# EAGLE schematic 2 (EAGLE 7.2.0)
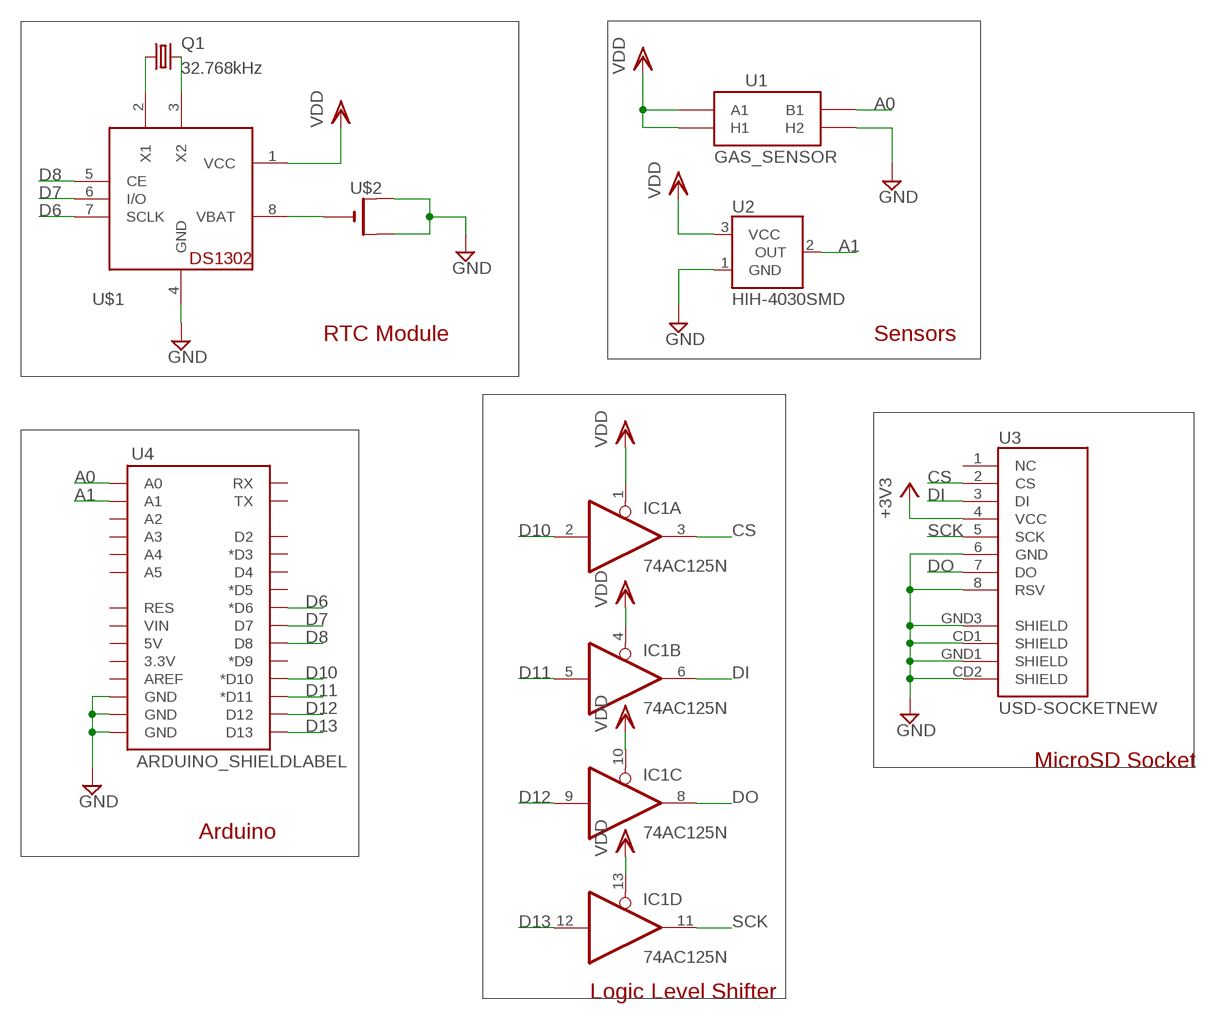
[diagram p0: schematic, sheet 1]

## Parts
IC1  74AC125N  [DIL14]
Q1  32.768kHz  CRYSTALTC38H  [TC38H]
U1  GAS_SENSOR  [MQ-3]
U2  HIH-4030SMD  [HIH-4030]
U3  USD-SOCKETNEW  [MICRO-SD-SOCKET-PP]
U4  ARDUINO_SHIELDLABEL  [DUEMILANOVE_SHIELD]
U$1  DS1302  [DIL08-ROUND]
U$2  CR2032THM  [CR2032-THRU]

## Nets
+3V3: U3.4(VCC)
A0: U1.B1 U4.A0
A1: U2.2(OUT) U4.A1
CS: IC1.3(A:O) U3.2(CS)
D6: U4.D6(*D6) U$1.7(SCLK)
D7: U4.D7 U$1.6(I/O)
D8: U4.D8 U$1.5(CE)
D10: IC1.2(A:I) U4.D10(*D10)
D11: IC1.5(B:I) U4.D11(*D11)
D12: IC1.9(C:I) U4.D12
D13: IC1.12(D:I) U4.D13
DI: IC1.6(B:O) U3.3(DI)
DO: IC1.8(C:O) U3.7(DO)
GND: U1.HB(H2) U2.1(GND) U3.6(GND) U3.8(RSV) U3.CD1(SHIELD) U3.CD2(SHIELD) U3.GND1(SHIELD) U3.GND3(SHIELD) U4.GND@0(GND) U4.GND@1(GND) U4.GND@2(GND) U$1.4(GND) U$2.+1(+) U$2.+2(+1)
N$1: U$1.8(VBAT) U$2.-
N$3: Q1.1 U$1.2(X1)
N$4: Q1.2 U$1.3(X2)
SCK: IC1.11(D:O) U3.5(SCK)
VDD: IC1.1(A:OE) IC1.4(B:OE) IC1.10(C:OE) IC1.13(D:OE) U1.A1 U1.HA(H1) U2.3(VCC) U$1.1(VCC)
Unconnected: U3.1(NC) U4.3.3V U4.5V U4.A2 U4.A3 U4.A4 U4.A5 U4.AREF U4.D2 U4.D3(*D3) U4.D4 U4.D5(*D5) U4.D9(*D9) U4.RES U4.RX U4.TX U4.VIN

## Notes on the sheet
- RTC Module | Sensors
- MicroSD Socket
- Arduino
- Logic Level Shifter

## Power pins joined to a net without a drawn wire
GND: IC1.7(P:GND)
VCC: IC1.14(P:VCC)

## Library data of the parts
IC1 = 74xx-eu:74*125: Quad bus BUFFER, 3-state
Q1 = crystal:CRYSTAL: CRYSTAL; OC_FARNELL: unknown; OC_NEWARK: unknown
U1 = SparkFun:GAS_SENSOR: MQ-3 Gas Sensor. FP not tested. Part#
U2 = SparkFun:HIH-4030: Humidity Sensor
U3 = SparkFun:USD-SOCKET: microSD Socket Push-push type uSD socket. Schematic element and footprint production proven. Spark Fun Electronics SKU : PRT-00127. tDoc lines correctly indicate media card edge positions when inserting (unlocked, locked, depressed).
U4 = SparkFun:ARDUINO_SHIELD
U$1 = adafruit:DS1302: DS1302 - Real time clock with supercap trickle charger
U$2 = adafruit:CR2032